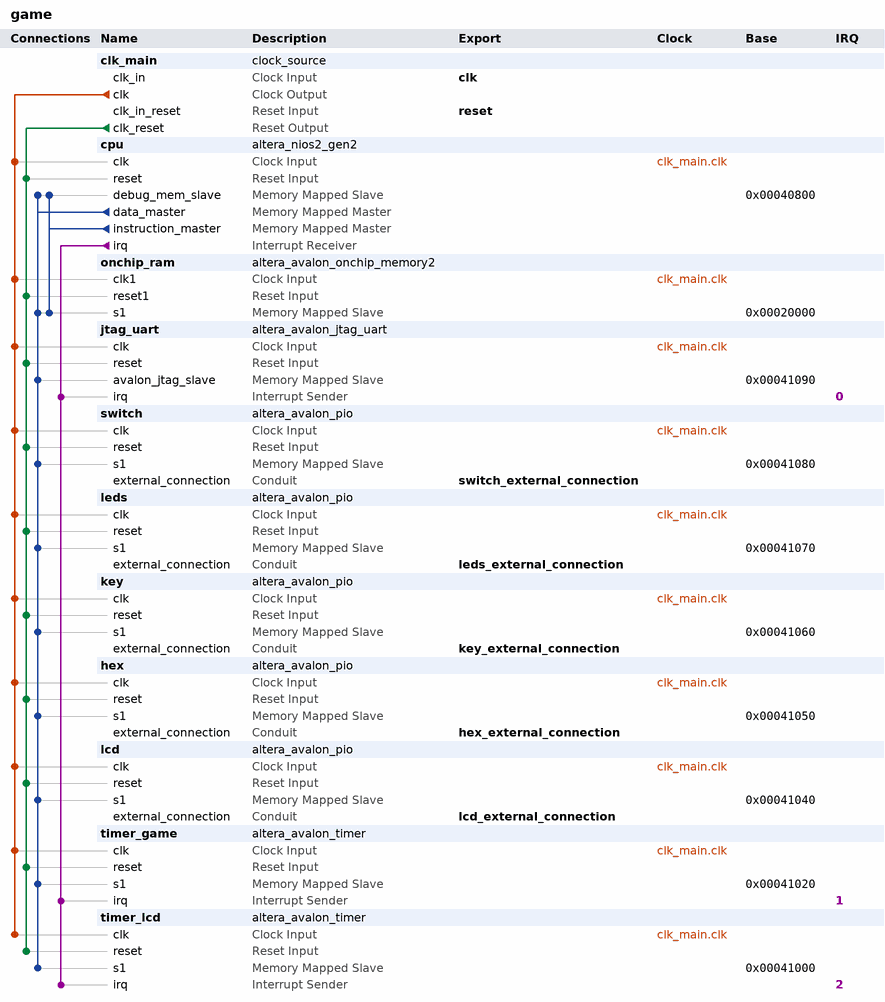
[diagram p0: system contents]
# Platform Designer (Qsys) system game, Cyclone IV E EP4CE115F29C7
# Parameters at their usual value, and those the tool derives, are not listed.
package require -exact qsys 18.0
create_system game
set_project_property DEVICE_FAMILY {Cyclone IV E}
set_project_property DEVICE EP4CE115F29C7

add_instance clk_main clock_source 18.0
set_instance_parameter_value clk_main clockFrequency 50000000

add_instance cpu altera_nios2_gen2 18.0
set_instance_parameter_value cpu dcache_size 2048
set_instance_parameter_value cpu exceptionSlave onchip_ram.s1
set_instance_parameter_value cpu icache_size 4096
set_instance_parameter_value cpu impl Tiny
set_instance_parameter_value cpu resetSlave onchip_ram.s1

add_instance onchip_ram altera_avalon_onchip_memory2 18.0
set_instance_parameter_value onchip_ram dataWidth 32
set_instance_parameter_value onchip_ram dualPort false
set_instance_parameter_value onchip_ram initMemContent false
set_instance_parameter_value onchip_ram initializationFileName onchip_mem.hex
set_instance_parameter_value onchip_ram memorySize 102400

add_instance jtag_uart altera_avalon_jtag_uart 18.0
set_instance_parameter_value jtag_uart simInteractiveOptions NO_INTERACTIVE_WINDOWS

add_instance switch altera_avalon_pio 18.0
set_instance_parameter_value switch direction Input
set_instance_parameter_value switch width 1

add_instance leds altera_avalon_pio 18.0
set_instance_parameter_value leds direction Output
set_instance_parameter_value leds width 4

add_instance key altera_avalon_pio 18.0
set_instance_parameter_value key direction Input
set_instance_parameter_value key width 1

add_instance hex altera_avalon_pio 18.0
set_instance_parameter_value hex direction Output
set_instance_parameter_value hex width 28

add_instance lcd altera_avalon_pio 18.0
set_instance_parameter_value lcd direction Output
set_instance_parameter_value lcd width 12

add_instance timer_game altera_avalon_timer 18.0
set_instance_parameter_value timer_game period 5000000
set_instance_parameter_value timer_game periodUnits CLOCKS

add_instance timer_lcd altera_avalon_timer 18.0
set_instance_parameter_value timer_lcd period 100000
set_instance_parameter_value timer_lcd periodUnits CLOCKS

# connections
add_connection clk_main.clk cpu.clk clock
add_connection clk_main.clk hex.clk clock
add_connection clk_main.clk jtag_uart.clk clock
add_connection clk_main.clk key.clk clock
add_connection clk_main.clk lcd.clk clock
add_connection clk_main.clk leds.clk clock
add_connection clk_main.clk onchip_ram.clk1 clock
add_connection clk_main.clk switch.clk clock
add_connection clk_main.clk timer_game.clk clock
add_connection clk_main.clk timer_lcd.clk clock
add_connection clk_main.clk_reset cpu.reset reset
add_connection clk_main.clk_reset hex.reset reset
add_connection clk_main.clk_reset jtag_uart.reset reset
add_connection clk_main.clk_reset key.reset reset
add_connection clk_main.clk_reset lcd.reset reset
add_connection clk_main.clk_reset leds.reset reset
add_connection clk_main.clk_reset onchip_ram.reset1 reset
add_connection clk_main.clk_reset switch.reset reset
add_connection clk_main.clk_reset timer_game.reset reset
add_connection clk_main.clk_reset timer_lcd.reset reset
add_connection cpu.data_master cpu.debug_mem_slave avalon
set_connection_parameter_value cpu.data_master/cpu.debug_mem_slave baseAddress 0x00040800
add_connection cpu.data_master hex.s1 avalon
set_connection_parameter_value cpu.data_master/hex.s1 baseAddress 0x00041050
add_connection cpu.data_master jtag_uart.avalon_jtag_slave avalon
set_connection_parameter_value cpu.data_master/jtag_uart.avalon_jtag_slave baseAddress 0x00041090
add_connection cpu.data_master key.s1 avalon
set_connection_parameter_value cpu.data_master/key.s1 baseAddress 0x00041060
add_connection cpu.data_master lcd.s1 avalon
set_connection_parameter_value cpu.data_master/lcd.s1 baseAddress 0x00041040
add_connection cpu.data_master leds.s1 avalon
set_connection_parameter_value cpu.data_master/leds.s1 baseAddress 0x00041070
add_connection cpu.data_master onchip_ram.s1 avalon
set_connection_parameter_value cpu.data_master/onchip_ram.s1 baseAddress 0x00020000
add_connection cpu.data_master switch.s1 avalon
set_connection_parameter_value cpu.data_master/switch.s1 baseAddress 0x00041080
add_connection cpu.data_master timer_game.s1 avalon
set_connection_parameter_value cpu.data_master/timer_game.s1 baseAddress 0x00041020
add_connection cpu.data_master timer_lcd.s1 avalon
set_connection_parameter_value cpu.data_master/timer_lcd.s1 baseAddress 0x00041000
add_connection cpu.instruction_master cpu.debug_mem_slave avalon
set_connection_parameter_value cpu.instruction_master/cpu.debug_mem_slave baseAddress 0x00040800
add_connection cpu.instruction_master onchip_ram.s1 avalon
set_connection_parameter_value cpu.instruction_master/onchip_ram.s1 baseAddress 0x00020000
add_connection cpu.irq jtag_uart.irq interrupt
set_connection_parameter_value cpu.irq/jtag_uart.irq irqNumber 0
add_connection cpu.irq timer_game.irq interrupt
set_connection_parameter_value cpu.irq/timer_game.irq irqNumber 1
add_connection cpu.irq timer_lcd.irq interrupt
set_connection_parameter_value cpu.irq/timer_lcd.irq irqNumber 2

# exported interfaces
add_interface clk clock sink
set_interface_property clk EXPORT_OF clk_main.clk_in
add_interface hex_external_connection conduit end
set_interface_property hex_external_connection EXPORT_OF hex.external_connection
add_interface key_external_connection conduit end
set_interface_property key_external_connection EXPORT_OF key.external_connection
add_interface lcd_external_connection conduit end
set_interface_property lcd_external_connection EXPORT_OF lcd.external_connection
add_interface leds_external_connection conduit end
set_interface_property leds_external_connection EXPORT_OF leds.external_connection
add_interface reset reset sink
set_interface_property reset EXPORT_OF clk_main.clk_in_reset
add_interface switch_external_connection conduit end
set_interface_property switch_external_connection EXPORT_OF switch.external_connection

set_interconnect_requirement {$system} qsys_mm.clockCrossingAdapter HANDSHAKE
set_interconnect_requirement {$system} qsys_mm.enableEccProtection FALSE
set_interconnect_requirement {$system} qsys_mm.insertDefaultSlave FALSE
set_interconnect_requirement {$system} qsys_mm.maxAdditionalLatency 1

save_system game.qsys
